# Altium schematic sheet jtag.SchDoc: JTAG and RS232 Connector
size A4; Organization: Berne University of Applied Science; Address1: School of Engineering and; Address2: Information Technology; Address3: Quellgasse 21; Address4: CH-2501 Biel; Revision: 1.0; SheetNumber: 17; SheetTotal: 19; ApprovedBy: zem1; Author: zac1
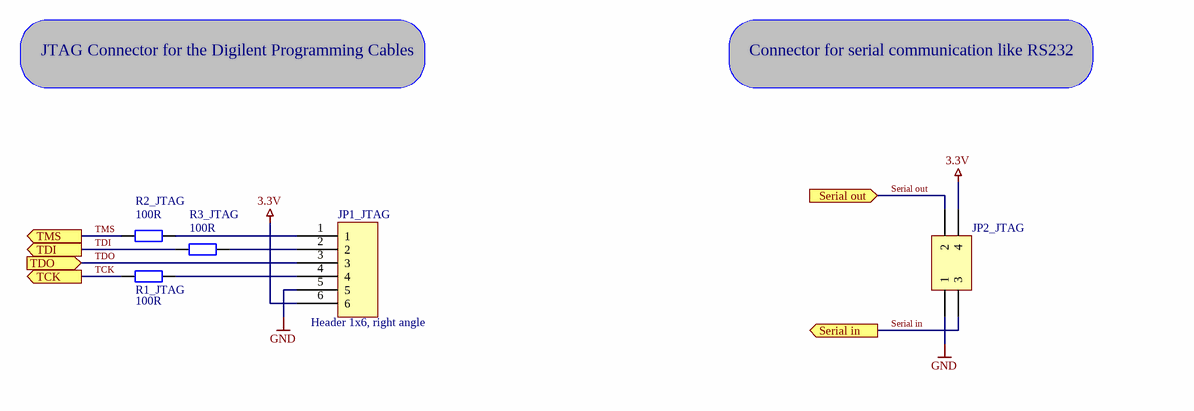
[diagram p0: jtag.SchDoc]

## Parts
JP1_JTAG  value Header 1x6, right angle  [HDR1X6H-90°]  (hidden comment: Header 6H)
JP2_JTAG  M22-2040205  [M22-2040205]  (value not drawn)
R1_JTAG  value 100R  [0402]  (hidden comment: Res2)
R2_JTAG  value 100R  [0402]  (hidden comment: Res2)
R3_JTAG  value 100R  [0402]  (hidden comment: Res2)

## Ports
Serial in (out), Serial out (in), TCK (out), TDI (out), TDO (in), TMS (out)

## Nets
3.3V: JP1_JTAG.6 JP2_JTAG.4
GND: JP1_JTAG.5 JP2_JTAG.1
Serial in: JP2_JTAG.3 ; port Serial in
Serial out: JP2_JTAG.2 ; port Serial out
TCK: R1_JTAG.1 ; port TCK
TDI: R3_JTAG.1 ; port TDI
TDO: JP1_JTAG.3 ; port TDO
TMS: R2_JTAG.1 ; port TMS
NetJP1_JTAG_1: JP1_JTAG.1 R2_JTAG.2
NetJP1_JTAG_2: JP1_JTAG.2 R3_JTAG.2
NetJP1_JTAG_4: JP1_JTAG.4 R1_JTAG.2

## Notes on the sheet
- JTAG Connector for the Digilent Programming Cables
- Connector for serial communication like RS232
- Title:
- Size:
- Date:
- A4_L
- Author:
- Time:
- Revision:
- Sheet
- of
- File:

## Library data of the parts
JP1_JTAG = JTAG_CONNECTOR: Header, 6-Pin,  Right Angle; Manufacturer: Fischer; Part Number: SL1/53/36 Z; Currency: CHF; Packaging unit: 6; Prize: 2.69; Distributor Number: 122 201; RoHS: yes; Distributor: Distrelec
JP2_JTAG = M22-2040205: Manufacturer: HARWIN; Currency: CHF; Packaging unit: 1; Prize: 1.2; VALUE: M22-2040205; Part Number: M22-2040205; RoHS: yes; Distributor Number: 672 208; Distributor: Farnell
R1_JTAG R2_JTAG R3_JTAG = Res2: Resistor; Manufacturer: PHYCOMP; Part Number: 232270671001; Class I: Passive; Currency: CHF; Packaging unit: 50; Prize: 0.12; Published: 8-Jun-2000; Revision: July-2002: Re-released for DXP Platform.; Publisher: Altium Limited; Class II: Resistor; Distributor Number: 9239111; RoHS: yes; Distributor: Farnell